# Altium schematic sheet Monitoring IC.SchDoc
size A4
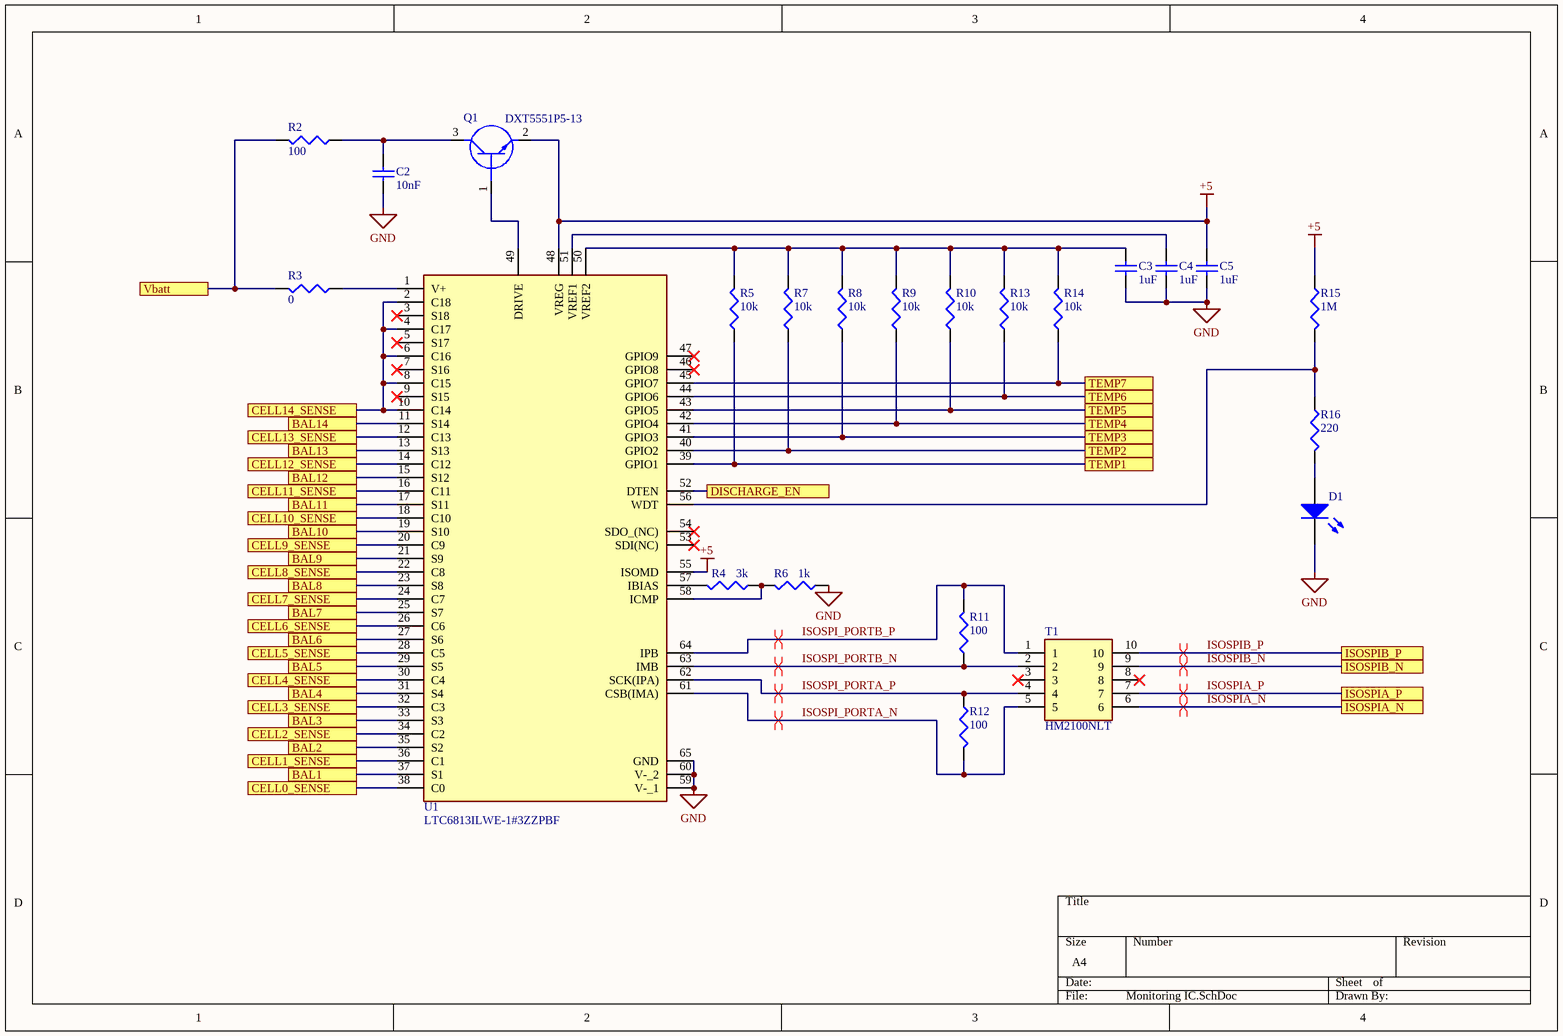
[diagram p0: Monitoring IC.SchDoc]

## Parts
C2  value 10nF  [0603 - Capacitor]  (hidden comment: Cap)
C3  value 1uF  [0603 - Capacitor]  (hidden comment: Cap)
C4  value 1uF  [0603 - Capacitor]  (hidden comment: Cap)
C5  value 1uF  [0603 - Capacitor]  (hidden comment: Cap)
D1  LED2  [DIOC1608X06N]  (value not drawn)
Q1  DXT5551P5-13  [DXT5551P513]
R2  value 100  [0603 - Resistor]  (hidden comment: Res3)
R3  value 0  [0603 - Resistor]  (hidden comment: Res3)
R4  value 3k  [0603 - Resistor]  (hidden comment: Res3)
R5  value 10k  [0603 - Resistor]  (hidden comment: Res3)
R6  value 1k  [0603 - Resistor]  (hidden comment: Res3)
R7  value 10k  [0603 - Resistor]  (hidden comment: Res3)
R8  value 10k  [0603 - Resistor]  (hidden comment: Res3)
R9  value 10k  [0603 - Resistor]  (hidden comment: Res3)
R10  value 10k  [0603 - Resistor]  (hidden comment: Res3)
R11  value 100  [0603 - Resistor]  (hidden comment: Res3)
R12  value 100  [0603 - Resistor]  (hidden comment: Res3)
R13  value 10k  [0603 - Resistor]  (hidden comment: Res3)
R14  value 10k  [0603 - Resistor]  (hidden comment: Res3)
R15  value 1M  [0603 - Resistor]  (hidden comment: Res3)
R16  value 220  [0603 - Resistor]  (hidden comment: Res3)
T1  HM2100NLT  [HM2100NLT]
U1  LTC6813ILWE-1#3ZZPBF  [QFP50P1200X1200X120-65N]

## Ports
BAL1, BAL2, BAL3, BAL4, BAL5, BAL6, BAL7, BAL8, BAL9, BAL10, BAL11, BAL12, BAL13, BAL14, CELL0_SENSE, CELL1_SENSE, CELL2_SENSE, CELL3_SENSE, CELL4_SENSE, CELL5_SENSE, CELL6_SENSE, CELL7_SENSE, CELL8_SENSE, CELL9_SENSE, CELL10_SENSE, CELL11_SENSE, CELL12_SENSE, CELL13_SENSE, CELL14_SENSE, DISCHARGE_EN, ISOSPIA_N, ISOSPIA_P, ISOSPIB_N, ISOSPIB_P, TEMP1, TEMP2, TEMP3, TEMP4, TEMP5, TEMP6, TEMP7, Vbatt

## Nets
+5: C5.2 Q1.2(E) R15.1 U1.48(VREG) U1.55(ISOMD)
GND: C2.1 C3.1 C4.1 C5.1 D1.2(K) R6.1 U1.59(V-_1) U1.60(V-_2) U1.65(GND)
BAL1: U1.37(S1) ; port BAL1
BAL2: U1.35(S2) ; port BAL2
BAL3: U1.33(S3) ; port BAL3
BAL4: U1.31(S4) ; port BAL4
BAL5: U1.29(S5) ; port BAL5
BAL6: U1.27(S6) ; port BAL6
BAL7: U1.25(S7) ; port BAL7
BAL8: U1.23(S8) ; port BAL8
BAL9: U1.21(S9) ; port BAL9
BAL10: U1.19(S10) ; port BAL10
BAL11: U1.17(S11) ; port BAL11
BAL12: U1.15(S12) ; port BAL12
BAL13: U1.13(S13) ; port BAL13
BAL14: U1.11(S14) ; port BAL14
CELL0_SENSE: U1.38(C0) ; port CELL0_SENSE
CELL1_SENSE: U1.36(C1) ; port CELL1_SENSE
CELL2_SENSE: U1.34(C2) ; port CELL2_SENSE
CELL3_SENSE: U1.32(C3) ; port CELL3_SENSE
CELL4_SENSE: U1.30(C4) ; port CELL4_SENSE
CELL5_SENSE: U1.28(C5) ; port CELL5_SENSE
CELL6_SENSE: U1.26(C6) ; port CELL6_SENSE
CELL7_SENSE: U1.24(C7) ; port CELL7_SENSE
CELL8_SENSE: U1.22(C8) ; port CELL8_SENSE
CELL9_SENSE: U1.20(C9) ; port CELL9_SENSE
CELL10_SENSE: U1.18(C10) ; port CELL10_SENSE
CELL11_SENSE: U1.16(C11) ; port CELL11_SENSE
CELL12_SENSE: U1.14(C12) ; port CELL12_SENSE
CELL13_SENSE: U1.12(C13) ; port CELL13_SENSE
CELL14_SENSE: U1.2(C18) U1.4(C17) U1.6(C16) U1.8(C15) U1.10(C14) ; port CELL14_SENSE
DISCHARGE_EN: U1.52(DTEN) ; port DISCHARGE_EN
ISOSPI_PORTA_N: R12.2 T1.5 U1.61(CSB(IMA))
ISOSPI_PORTA_P: R12.1 T1.4 U1.62(SCK(IPA))
ISOSPI_PORTB_N: R11.1 T1.2 U1.63(IMB)
ISOSPI_PORTB_P: R11.2 T1.1 U1.64(IPB)
ISOSPIA_N: T1.6 ; port ISOSPIA_N
ISOSPIA_P: T1.7 ; port ISOSPIA_P
ISOSPIB_N: T1.9 ; port ISOSPIB_N
ISOSPIB_P: T1.10 ; port ISOSPIB_P
TEMP1: R5.1 U1.39(GPIO1) ; port TEMP1
TEMP2: R7.1 U1.40(GPIO2) ; port TEMP2
TEMP3: R8.1 U1.41(GPIO3) ; port TEMP3
TEMP4: R9.1 U1.42(GPIO4) ; port TEMP4
TEMP5: R10.1 U1.43(GPIO5) ; port TEMP5
TEMP6: R13.1 U1.44(GPIO6) ; port TEMP6
TEMP7: R14.1 U1.45(GPIO7) ; port TEMP7
Vbatt: R2.1 R3.1 ; port Vbatt
NetC2_2: C2.2 Q1.3(C) R2.2
NetC3_2: C3.2 R5.2 R7.2 R8.2 R9.2 R10.2 R13.2 R14.2 U1.50(VREF2)
NetC4_2: C4.2 U1.51(VREF1)
NetD1_1: D1.1(A) R16.2
NetQ1_1: Q1.1(B) U1.49(DRIVE)
NetR3_2: R3.2 U1.1(V+)
NetR4_1: R4.1 R6.2 U1.58(ICMP)
NetR4_2: R4.2 U1.57(IBIAS)
NetR15_2: R15.2 R16.1 U1.56(WDT)

Not connected (* = marked no-connect by the designer): T1 3* 8*; U1 3(S18)* 5(S17)* 7(S16)* 9(S15)* 46(GPIO8)* 47(GPIO9)* 53(SDI(NC))* 54(SDO_(NC))*

## Layout directives
differential pair: ISOSPI_PORTA_N
differential pair; differential pair class ISOSPI_PORTA_N: ISOSPI_PORTA_P, ISOSPI_PORTB_N, ISOSPI_PORTB_P, ISOSPIA_N, ISOSPIA_P, ISOSPIB_N, ISOSPIB_P

## Library data of the parts
C2-C5 = Cap: Capacitor; Published: 8-Jun-2000; LatestRevisionDate: 17-Jul-2002; LatestRevisionNote: Re-released for DXP Platform.; PackageReference: RAD-0.3; Publisher: Altium Limited; PackageDescription: Radial Cap, Thru-Hole; 2 Leads; 0.3 in Pin Spacing
D1 = LED2: Typical RED, GREEN, YELLOW, AMBER GaAs LED; Published: 8-Jun-2000; LatestRevisionDate: 17-Jul-2002; LatestRevisionNote: Re-released for DXP Platform.; PackageVersion: Feb-2002; PackageReference: 3.2X1.6X1.1; Publisher: Altium Limited; PackageDescription: SM LED; 2 Flat Leads
Q1 = DXT5551P5-13: Transistor BJT NPN; Manufacturer_Name: Diodes Inc.; Datasheet Link: https://www.diodes.com/assets/Datasheets/DXT5551P5.pdf; Manufacturer_Part_Number: DXT5551P5-13; Mouser Part Number: 522-DXT5551P5-13; Mouser Price/Stock: https://www.mouser.com/Search/Refine.aspx?Keyword=522-DXT5551P5-13
R2-R16 = Res3: Resistor; Published: 8-Jun-2000; LatestRevisionDate: 29-May-2009; LatestRevisionNote: IPC-7351 Footprint Added.; PackageReference: J1-0603; Publisher: Altium Limited; PackageDescription: Chip Resistor
T1 = HM2100NLT: Transformer; Manufacturer_Name: Pulse; Datasheet Link: https://productfinder.pulseeng.com/doc_type/WEB301/doc_num/HM2100NL/doc_part/HM2100NL.pdf; Height: 3.45mm; Manufacturer_Part_Number: HM2100NLT; Mouser Part Number: 673-HM2100NLT; Mouser Price/Stock: https://www.mouser.com/Search/Refine.aspx?Keyword=673-HM2100NLT
U1 = LTC6813ILWE-1#3ZZPBF: Integrated Circuit; Manufacturer_Name: Analog Devices; Datasheet Link: https://www.analog.com/media/en/technical-documentation/data-sheets/68131f.pdf; Height: 1.6mm; Manufacturer_Part_Number: LTC6813ILWE-1#3ZZPBF; Mouser Part Number: 584-6813ILWE13ZZPBF